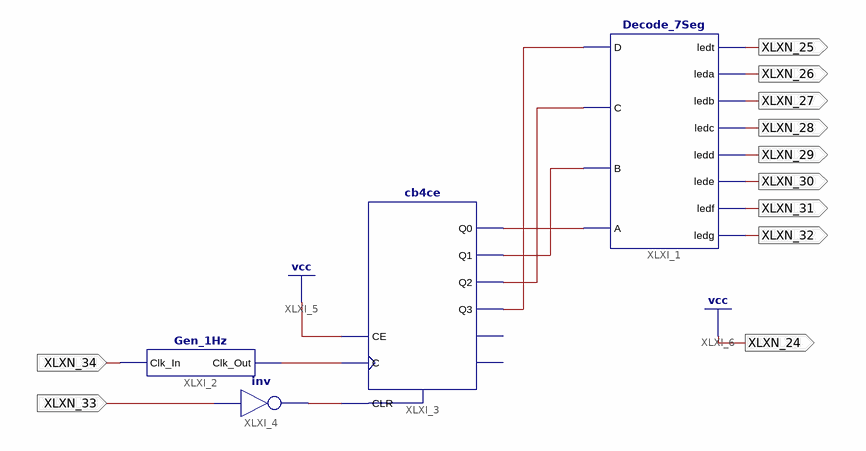
[diagram p0: schematic sheet 1]
// Xilinx ISE schematic mmm.sch (spartan6) as structural Verilog: 4 symbols, 11 ports
module mmm (
  input  XLXN_33,
  input  XLXN_34,
  output XLXN_24,
  output XLXN_25,
  output XLXN_26,
  output XLXN_27,
  output XLXN_28,
  output XLXN_29,
  output XLXN_30,
  output XLXN_31,
  output XLXN_32
);

  wire XLXN_1, XLXN_2, XLXN_4, XLXN_5, XLXN_6, XLXN_23;

  Decode_7Seg XLXI_1 (
    .D(XLXN_2), .C(XLXN_4), .B(XLXN_5), .A(XLXN_6), .ledt(XLXN_25), .leda(XLXN_26), .ledb(XLXN_27),
    .ledc(XLXN_28), .ledd(XLXN_29), .lede(XLXN_30), .ledf(XLXN_31), .ledg(XLXN_32));
  Gen_1Hz XLXI_2 (.Clk_In(XLXN_34), .Clk_Out(XLXN_1));
  cb4ce XLXI_3 (
    .C(XLXN_1), .CE(1'b1), .CLR(XLXN_23), .Q0(XLXN_6), .Q1(XLXN_5), .Q2(XLXN_4), .Q3(XLXN_2));  // open: CEO, TC
  not XLXI_4 (XLXN_23, XLXN_33);

  assign XLXN_24 = 1'b1;
endmodule
